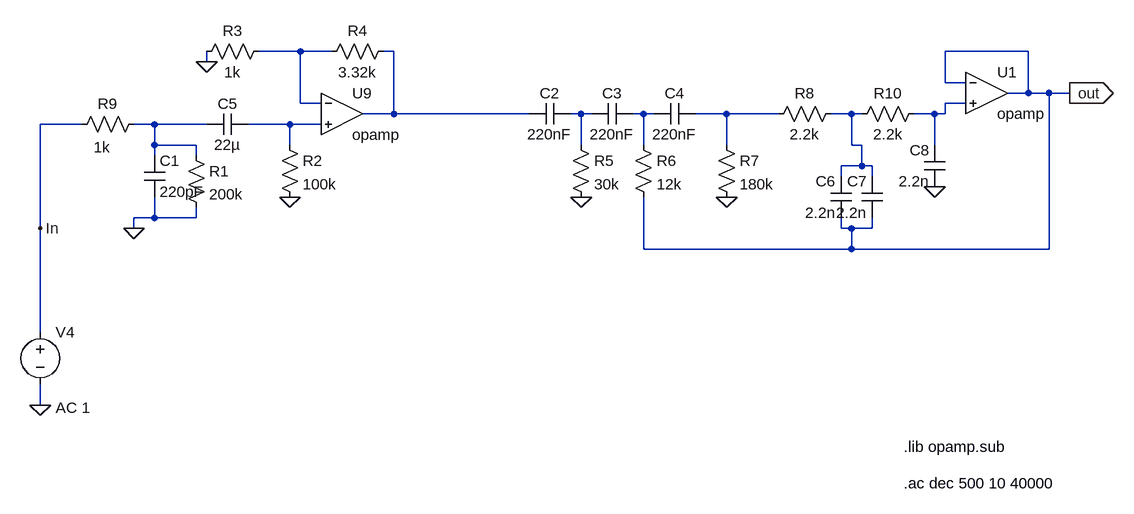
[diagram p0: schematic input-stage-ltspice.asc]
input-stage-ltspice.asc, the LTspice schematic file:
Version 4
SHEET 1 1268 792
WIRE -1808 -400 -1872 -400
WIRE -1760 -400 -1808 -400
WIRE -1664 -400 -1680 -400
WIRE -688 -400 -816 -400
WIRE -1952 -384 -1952 -400
WIRE -816 -352 -816 -400
WIRE -784 -352 -816 -352
WIRE -688 -336 -688 -400
WIRE -688 -336 -720 -336
WIRE -656 -336 -688 -336
WIRE -624 -336 -656 -336
WIRE -1808 -320 -1808 -400
WIRE -1776 -320 -1808 -320
WIRE -784 -320 -816 -320
WIRE -624 -320 -624 -336
WIRE -1664 -304 -1664 -400
WIRE -1664 -304 -1712 -304
WIRE -1456 -304 -1664 -304
WIRE -1376 -304 -1392 -304
WIRE -1360 -304 -1376 -304
WIRE -1280 -304 -1296 -304
WIRE -1264 -304 -1280 -304
WIRE -1152 -304 -1200 -304
WIRE -1072 -304 -1152 -304
WIRE -960 -304 -992 -304
WIRE -944 -304 -960 -304
WIRE -832 -304 -864 -304
WIRE -816 -304 -816 -320
WIRE -816 -304 -832 -304
WIRE -2144 -288 -2208 -288
WIRE -2032 -288 -2064 -288
WIRE -1952 -288 -2032 -288
WIRE -1824 -288 -1888 -288
WIRE -1776 -288 -1824 -288
WIRE -2032 -256 -2032 -288
WIRE -1968 -256 -2032 -256
WIRE -1824 -256 -1824 -288
WIRE -1376 -256 -1376 -304
WIRE -1280 -256 -1280 -304
WIRE -1152 -256 -1152 -304
WIRE -960 -256 -960 -304
WIRE -944 -256 -960 -256
WIRE -832 -256 -832 -304
WIRE -2032 -240 -2032 -256
WIRE -1968 -240 -1968 -256
WIRE -944 -224 -944 -256
WIRE -944 -224 -976 -224
WIRE -928 -224 -944 -224
WIRE -976 -208 -976 -224
WIRE -928 -208 -928 -224
WIRE -2032 -144 -2032 -176
WIRE -2032 -144 -2064 -144
WIRE -1968 -144 -1968 -160
WIRE -1968 -144 -2032 -144
WIRE -2208 -128 -2208 -288
WIRE -2064 -128 -2064 -144
WIRE -976 -128 -976 -144
WIRE -960 -128 -976 -128
WIRE -928 -128 -928 -144
WIRE -928 -128 -960 -128
WIRE -1280 -96 -1280 -176
WIRE -960 -96 -960 -128
WIRE -960 -96 -1280 -96
WIRE -656 -96 -656 -336
WIRE -656 -96 -960 -96
WIRE -2208 32 -2208 -128
WIRE -2208 144 -2208 112
FLAG -2208 144 0
FLAG -624 -336 out
IOPIN -624 -336 Out
FLAG -2208 -128 In
FLAG -2064 -128 0
FLAG -1824 -176 0
FLAG -1952 -384 0
FLAG -1376 -176 0
FLAG -1152 -176 0
FLAG -832 -192 0
SYMBOL voltage -2208 16 R0
WINDOW 123 24 132 Left 2
WINDOW 39 0 0 Left 2
SYMATTR Value2 AC 1
SYMATTR InstName V4
SYMATTR Value ""
SYMBOL res -2048 -304 R90
WINDOW 0 0 56 VBottom 2
WINDOW 3 36 65 VTop 2
SYMATTR InstName R9
SYMATTR Value 1k
SYMBOL opamp -1744 -368 R0
SYMATTR InstName U9
SYMBOL cap -1888 -304 R90
WINDOW 0 0 32 VBottom 2
WINDOW 3 32 32 VTop 2
SYMATTR InstName C5
SYMATTR Value 22µ
SYMBOL cap -2048 -240 R0
SYMATTR InstName C1
SYMATTR Value 220pF
SYMBOL res -1984 -256 R0
SYMATTR InstName R1
SYMATTR Value 200k
SYMBOL res -1840 -272 R0
SYMATTR InstName R2
SYMATTR Value 100k
SYMBOL res -1856 -416 R90
WINDOW 0 0 56 VBottom 2
WINDOW 3 32 56 VTop 2
SYMATTR InstName R3
SYMATTR Value 1k
SYMBOL res -1664 -416 R90
WINDOW 0 0 56 VBottom 2
WINDOW 3 32 56 VTop 2
SYMATTR InstName R4
SYMATTR Value 3.32k
SYMBOL cap -1392 -320 R90
WINDOW 0 0 32 VBottom 2
WINDOW 3 32 32 VTop 2
SYMATTR InstName C2
SYMATTR Value 220nF
SYMBOL cap -1296 -320 R90
WINDOW 0 0 32 VBottom 2
WINDOW 3 32 32 VTop 2
SYMATTR InstName C3
SYMATTR Value 220nF
SYMBOL cap -1200 -320 R90
WINDOW 0 0 32 VBottom 2
WINDOW 3 32 32 VTop 2
SYMATTR InstName C4
SYMATTR Value 220nF
SYMBOL res -1392 -272 R0
SYMATTR InstName R5
SYMATTR Value 30k
SYMBOL res -1296 -272 R0
SYMATTR InstName R6
SYMATTR Value 12k
SYMBOL res -1168 -272 R0
SYMATTR InstName R7
SYMATTR Value 180k
SYMBOL res -976 -320 R90
WINDOW 0 0 56 VBottom 2
WINDOW 3 32 56 VTop 2
SYMATTR InstName R8
SYMATTR Value 2.2k
SYMBOL res -848 -320 R90
WINDOW 0 0 56 VBottom 2
WINDOW 3 32 56 VTop 2
SYMATTR InstName R10
SYMATTR Value 2.2k
SYMBOL opamp -752 -400 R0
SYMATTR InstName U1
SYMBOL cap -960 -144 R180
WINDOW 0 24 56 Left 2
WINDOW 3 24 8 Left 2
SYMATTR InstName C6
SYMATTR Value 2.2n
SYMBOL cap -912 -144 R180
WINDOW 0 24 56 Left 2
WINDOW 3 24 8 Left 2
SYMATTR InstName C7
SYMATTR Value 2.2n
SYMBOL cap -816 -192 R180
WINDOW 0 24 56 Left 2
WINDOW 3 24 8 Left 2
SYMATTR InstName C8
SYMATTR Value 2.2n
TEXT -880 264 Left 2 !.ac dec 500 10 40000
TEXT -880 208 Left 2 !.lib opamp.sub

The netlist it stands for:
* input-stage-ltspice.asc
V4 In 0 AC 1
R9 N008 In 1k
XU9 N001 N009 N002 opamp Aol=100K GBW=10Meg  ; pins invin noninvin out
C5 N009 N008 22µ
C1 N008 0 220pF
R1 N008 0 200k
R2 N009 0 100k
R3 N001 0 1k
R4 N002 N001 3.32k
C2 N004 N002 220nF
C3 N005 N004 220nF
C4 N006 N005 220nF
R5 N004 0 30k
R6 N005 out 12k
R7 N006 0 180k
R8 N007 N006 2.2k
R10 N003 N007 2.2k
XU1 out N003 out opamp Aol=100K GBW=10Meg  ; pins invin noninvin out
C6 out N007 2.2n
C7 out N007 2.2n
C8 0 N003 2.2n
.ac dec 500 10 40000
.lib opamp.sub
.backanno
.end